# EAGLE design main (EAGLE 8.3.1)
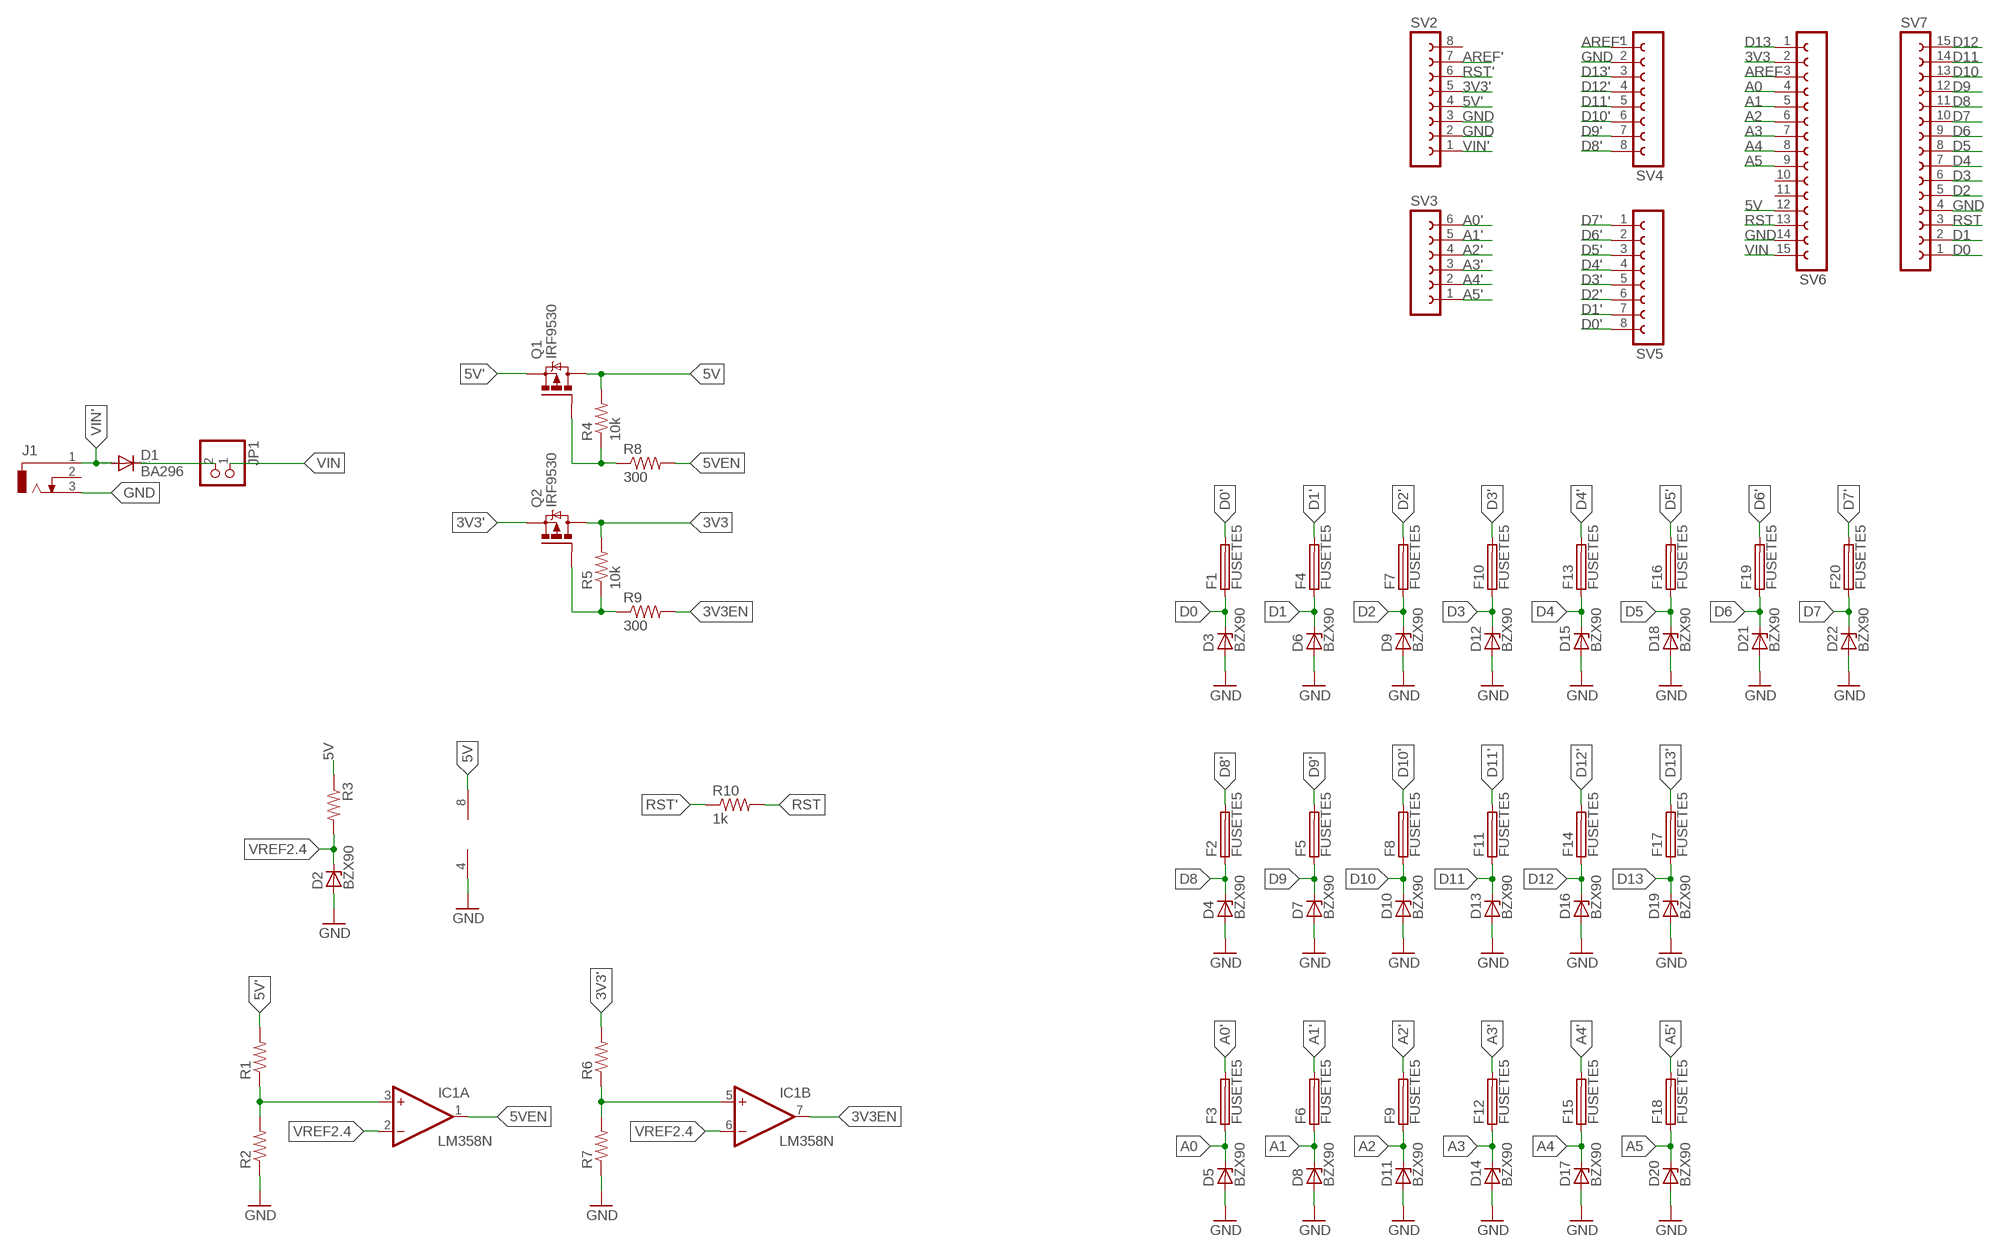
[diagram p0: schematic, sheet 1]

## Parts
D1  BA296  [P2-15]
D2  BZX90  [DO34Z7]
D3  BZX90  [DO34Z7]
D4  BZX90  [DO34Z7]
D5  BZX90  [DO34Z7]
D6  BZX90  [DO34Z7]
D7  BZX90  [DO34Z7]
D8  BZX90  [DO34Z7]
D9  BZX90  [DO34Z7]
D10  BZX90  [DO34Z7]
D11  BZX90  [DO34Z7]
D12  BZX90  [DO34Z7]
D13  BZX90  [DO34Z7]
D14  BZX90  [DO34Z7]
D15  BZX90  [DO34Z7]
D16  BZX90  [DO34Z7]
D17  BZX90  [DO34Z7]
D18  BZX90  [DO34Z7]
D19  BZX90  [DO34Z7]
D20  BZX90  [DO34Z7]
D21  BZX90  [DO34Z7]
D22  BZX90  [DO34Z7]
F1  FUSETE5  [TE5]
F2  FUSETE5  [TE5]
F3  FUSETE5  [TE5]
F4  FUSETE5  [TE5]
F5  FUSETE5  [TE5]
F6  FUSETE5  [TE5]
F7  FUSETE5  [TE5]
F8  FUSETE5  [TE5]
F9  FUSETE5  [TE5]
F10  FUSETE5  [TE5]
F11  FUSETE5  [TE5]
F12  FUSETE5  [TE5]
F13  FUSETE5  [TE5]
F14  FUSETE5  [TE5]
F15  FUSETE5  [TE5]
F16  FUSETE5  [TE5]
F17  FUSETE5  [TE5]
F18  FUSETE5  [TE5]
F19  FUSETE5  [TE5]
F20  FUSETE5  [TE5]
IC1  LM358N  [DIL08]
J1  DCJ0303  [DCJ0303]
JP1  PINHD-1X2  [1X02]
Q1  IRF9530  [TO220BV]
Q2  IRF9530  [TO220BV]
R1  R-US_0204/7  [0204/7]
R2  R-US_0204/7  [0204/7]
R3  R-US_0204/7  [0204/7]
R4  10k  R-US_0204/7  [0204/7]
R5  10k  R-US_0204/7  [0204/7]
R6  R-US_0204/7  [0204/7]
R7  R-US_0204/7  [0204/7]
R8  300  R-US_0204/7  [0204/7]
R9  300  R-US_0204/7  [0204/7]
R10  1k  R-US_0204/7  [0204/7]
SV2  FE08-1  [FE08]
SV3  FE06-1  [FE06]
SV4  FE08-1  [FE08]
SV5  FE08-1  [FE08]
SV6  FE15-1  [FE15]
SV7  FE15-1  [FE15]

## Nets
3V3: Q2.D R5.2 SV6.2
3V3': Q2.S R6.2 SV2.5
3V3EN: IC1.7(B:OUT) R9.2
5V: IC1.8(P:V+) Q1.D R3.1 R4.2 SV6.12
5V': Q1.S R1.2 SV2.4
5VEN: IC1.1(A:OUT) R8.2
A0: D5.C F3.1 SV6.4
A0': F3.2 SV3.6
A1: D8.C F6.1 SV6.5
A1': F6.2 SV3.5
A2: D11.C F9.1 SV6.6
A2': F9.2 SV3.4
A3: D14.C F12.1 SV6.7
A3': F12.2 SV3.3
A4: D17.C F15.1 SV6.8
A4': F15.2 SV3.2
A5: D20.C F18.1 SV6.9
A5': F18.2 SV3.1
AREF: SV6.3
AREF': SV2.7 SV4.1
D0: D3.C F1.1 SV7.1
D0': F1.2 SV5.8
D1: D6.C F4.1 SV7.2
D1': F4.2 SV5.7
D2: D9.C F7.1 SV7.5
D2': F7.2 SV5.6
D3: D12.C F10.1 SV7.6
D3': F10.2 SV5.5
D4: D15.C F13.1 SV7.7
D4': F13.2 SV5.4
D5: D18.C F16.1 SV7.8
D5': F16.2 SV5.3
D6: D21.C F19.1 SV7.9
D6': F19.2 SV5.2
D7: D22.C F20.1 SV7.10
D7': F20.2 SV5.1
D8: D4.C F2.1 SV7.11
D8': F2.2 SV4.8
D9: D7.C F5.1 SV7.12
D9': F5.2 SV4.7
D10: D10.C F8.1 SV7.13
D10': F8.2 SV4.6
D11: D13.C F11.1 SV7.14
D11': F11.2 SV4.5
D12: D16.C F14.1 SV7.15
D12': F14.2 SV4.4
D13: D19.C F17.1 SV6.1
D13': F17.2 SV4.3
GND: D2.A D3.A D4.A D5.A D6.A D7.A D8.A D9.A D10.A D11.A D12.A D13.A D14.A D15.A D16.A D17.A D18.A D19.A D20.A D21.A D22.A IC1.4(P:V-) J1.3 R2.1 R7.1 SV2.2 SV2.3 SV4.2 SV6.14 SV7.4
N$2: D1.C JP1.2
N$3: Q2.G R5.1 R9.1
N$4: Q1.G R4.1 R8.1
N$6: IC1.3(A:+IN) R1.1 R2.2
N$7: IC1.5(B:+IN) R6.1 R7.2
RST: R10.2 SV6.13 SV7.3
RST': R10.1 SV2.6
VIN: JP1.1 SV6.15
VIN': D1.A J1.1 SV2.1
VREF2.4: D2.C IC1.2(A:-IN) IC1.6(B:-IN) R3.2
Unconnected: J1.2 SV2.8 SV6.10 SV6.11

## Library data of the parts
D1 = diode:BA296: DIODE
D2-D22 = diode:BZX90: Z DIODE
F1-F20 = fuse:FUSE: Fuse; OC_FARNELL: unknown; OC_NEWARK: unknown
IC1 = linear:LM358: OP AMP also LM158; LM258; LM2904 Source: http://cache.national.com/ds/LM/LM158.pdf
J1 = con-jack:DCJ0303: DC POWER JACK Source: DCJ0303.pdf; OC_FARNELL: unknown; OC_NEWARK: unknown
JP1 = pinhead:PINHD-1X2: PIN HEADER
Q1 Q2 = transistor-power:IRF9530: P-CHANNEL HEXFET POWER-MOS-FET Source: http://www.irf.com/product-info/datasheets/data/irf9530.pdf
R1-R10 = rcl:R-US_: RESISTOR, American symbol
SV2 SV4 SV5 = con-lsta:FE08-1: FEMALE HEADER; OC_FARNELL: unknown; OC_NEWARK: unknown
SV3 = con-lsta:FE06-1: FEMALE HEADER; OC_FARNELL: unknown; OC_NEWARK: unknown
SV6 SV7 = con-lsta:FE15-1: FEMALE HEADER; OC_FARNELL: unknown; OC_NEWARK: unknown

## Board
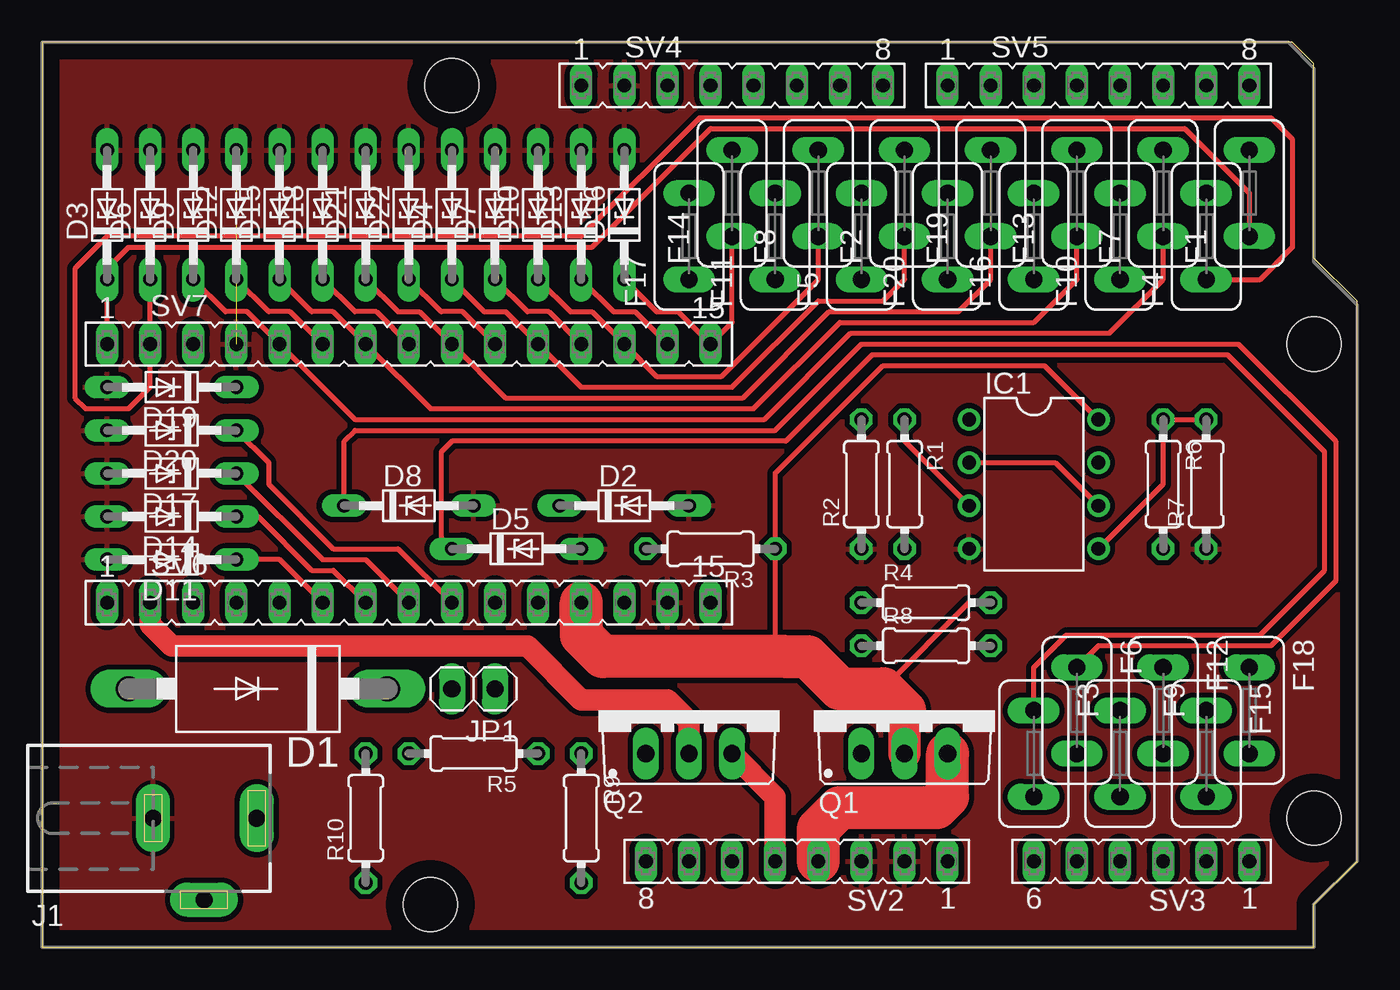
[diagram p1: board, top side]
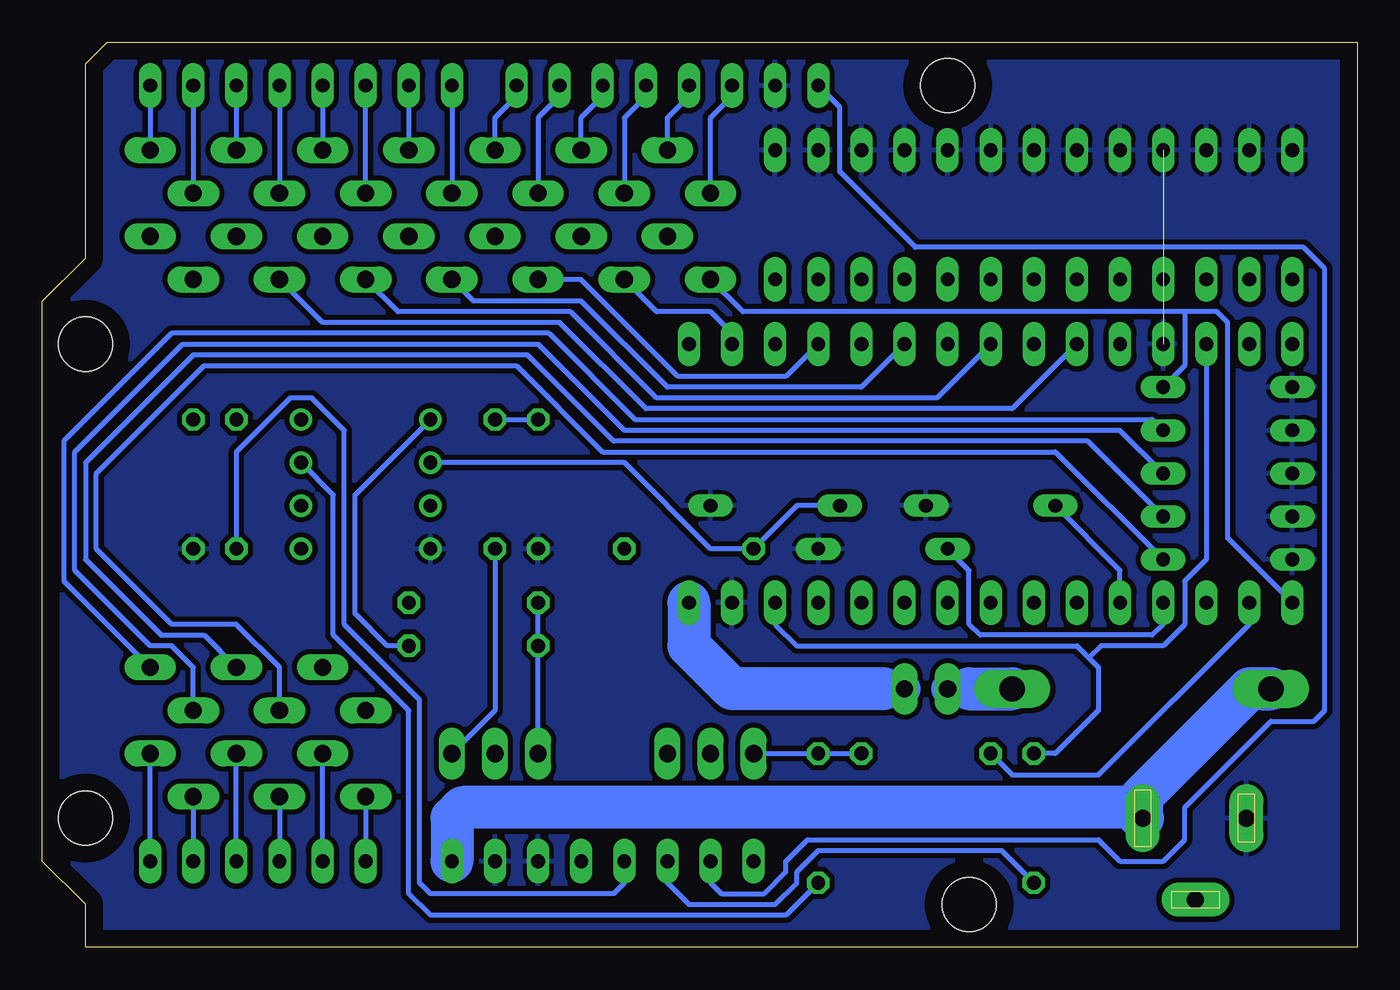
[diagram p2: board, bottom side, seen from below]

Size 77.47 x 53.34 mm. Coordinates in mm from the lower left corner, seen from the top.
Outline: 0,0 74.93,0 74.93,2.54 77.47,5.08 77.47,38.1 74.93,40.64 74.93,52.07 73.66,53.34 0,53.34 0,0
Copper layers (1*16): Top 0.035mm / dielectric 1.5mm / Bottom 0.035mm
Design rules "default": minimum track width 6mil, minimum drill 0.35mm, track to track 6mil, track to pad 6mil, pad to pad 6mil, via to via 6mil, smd to smd 6mil, copper to edge 40mil, drill to drill 6mil, minimum pad ring 10mil, minimum via ring 8mil, stop-mask expansion 4mil, vias tented up to drill 0mil, thermal gap 10mil
Holes 3.17 mm at 24.13,50.8 74.93,35.56 74.93,7.62 22.86,2.54

### Footprints (pad centres in the part's own frame; a part is rotated, then mirrored left to right if it is on the bottom)
P2-15 = drill 1.499 long: A 7.62,0; C -7.62,0
DO34Z7 = drill 0.813 long: A 3.81,0; C -3.81,0
TE5 = drill 1.016 long: 1 -2.54,0; 2 2.54,0
DIL08 = drill 0.813 pad 1.27: 1 -3.81,-3.81; 2 -1.27,-3.81; 3 1.27,-3.81; 4 3.81,-3.81; 5 3.81,3.81; 6 1.27,3.81; 7 -1.27,3.81; 8 -3.81,3.81
DCJ0303 = drill 1 pad 2 long: 1 0,3.1; 2 4.8,0; 3 0,-3
1X02 = drill 1.016 long: 1 -1.27,0; 2 1.27,0
TO220BV = drill 1.016 long: D 0,-2.54; G -2.54,-2.54; S 2.54,-2.54
0204/7 = drill 0.813 octagon: 1 -3.81,0; 2 3.81,0
FE08 = drill 0.813 long: 1 -8.89,0; 2 -6.35,0; 3 -3.81,0; 4 -1.27,0; 5 1.27,0; 6 3.81,0; 7 6.35,0; 8 8.89,0
FE06 = drill 0.813 long: 1 -6.35,0; 2 -3.81,0; 3 -1.27,0; 4 1.27,0; 5 3.81,0; 6 6.35,0
FE15 = drill 0.813 long: 1 -17.78,0; 2 -15.24,0; 3 -12.7,0; 4 -10.16,0; 5 -7.62,0; 6 -5.08,0; 7 -2.54,0; 8 0,0; 9 2.54,0; 10 5.08,0; 11 7.62,0; 12 10.16,0; 13 12.7,0; 14 15.24,0; 15 17.78,0

### Placement (x,y rotation side)
D1  12.7,15.24 180 top
D2  34.29,26.03 0 top
D3  3.81,43.18 90 top
D4  24.13,43.18 90 top
D5  27.94,23.49 0 top
D6  6.35,43.18 90 top
D7  26.67,43.18 90 top
D8  21.59,26.03 0 top
D9  8.89,43.18 90 top
D10  29.21,43.18 90 top
D11  7.62,22.86 180 top
D12  11.43,43.18 90 top
D13  31.75,43.18 90 top
D14  7.62,25.4 180 top
D15  13.97,43.18 90 top
D16  34.29,43.18 90 top
D17  7.62,27.94 180 top
D18  16.51,43.18 90 top
D19  7.62,33.02 180 top
D20  7.62,30.48 180 top
D21  19.05,43.18 90 top
D22  21.59,43.18 90 top
F1  71.12,44.45 90 top
F2  50.8,44.45 90 top
F3  58.42,11.43 270 top
F4  68.58,41.91 90 top
F5  48.26,41.91 90 top
F6  60.96,13.97 270 top
F7  66.04,44.45 90 top
F8  45.72,44.45 90 top
F9  63.5,11.43 270 top
F10  63.5,41.91 90 top
F11  43.18,41.91 90 top
F12  66.04,13.97 270 top
F13  60.96,44.45 90 top
F14  40.64,44.45 90 top
F15  68.58,11.43 270 top
F16  58.42,41.91 90 top
F17  38.1,41.91 90 top
F18  71.12,13.97 270 top
F19  55.88,44.45 90 top
F20  53.34,41.91 90 top
IC1  58.42,27.3 270 top
J1  9.53,7.62 270 top
JP1  25.4,15.24 180 top
Q1  50.8,13.97 0 top
Q2  38.1,13.97 0 top
R1  50.8,27.3 270 top
R2  48.26,27.3 90 top
R3  39.37,23.49 180 top
R4  52.07,20.32 0 top
R5  25.4,11.43 180 top
R6  66.04,27.3 270 top
R7  68.58,27.3 90 top
R8  52.07,17.78 0 top
R9  31.75,7.62 270 top
R10  19.05,7.62 90 top
SV2  44.45,5.08 180 top
SV3  64.77,5.08 180 top
SV4  40.64,50.8 0 top
SV5  62.23,50.8 0 top
SV6  21.59,20.32 0 top
SV7  21.59,35.56 0 top

### Tracks (layer width: path | path; a pad name or v marks a point on that pad's centre or on a via)
3V3
  Top 1.27: SV6.2 6.35,19.05 7.62,17.78 28.57,17.78 31.75,14.6 36.83,14.6 38.1,13.34 Q2.D
  Bottom 0.305: R5.2 20.32,10.16 15.24,10.16 6.35,19.05 SV6.2
3V3'
  Top 1.27: SV2.5 43.18,8.89 Q2.S
  Bottom 0.305: SV2.5 43.18,3.81 43.81,3.18 54.61,3.18 55.24,3.81 55.24,14.6 59.69,19.05 59.69,30.48 61.59,32.38 62.87,32.38 66.04,29.21 R6.2
3V3EN
  Bottom 0.305: R9.2 33.66,1.91 54.61,1.91 55.88,3.18 55.88,13.97 60.32,18.41 60.32,26.67 IC1.7
5V
  Top 0.305: R4.2 54.61,20.32 49.53,15.24 | IC1.8 59.05,34.29 49.53,34.29 43.18,27.94 R3.1 43.18,17.79 43.82,17.15
  Top 1.905: Q1.D 50.8,13.97
  Top 2.54: 31.75,19.05 SV6.12 31.75,18.41 33.02,17.15 43.82,17.15 45.09,17.15 46.99,15.24 49.53,15.24 50.8,13.97
5V'
  Top 2.54: SV2.4 45.72,6.98 46.99,8.25 52.7,8.25 53.34,8.89 Q1.S
  Bottom 0.305: R1.2 50.8,13.97 Q1.S
5VEN
  Bottom 0.305: R8.2 57.15,17.78 59.05,19.69 59.05,26.67 IC1.1
A0
  Top 0.305: F3.1 58.42,16.51 60.32,18.41 71.76,18.41 75.57,22.23 75.57,29.21 69.85,34.92 48.89,34.92 43.81,29.84 24.13,29.84 23.49,29.21 23.49,24.13 D5.C
  Bottom 0.305: SV6.4 11.43,19.05 12.06,18.41 22.23,18.41 22.86,19.05 22.86,22.23 D5.C
A0'
  Bottom 0.305: F3.2 SV3.6
A1
  Top 0.305: D8.C 17.78,29.84 18.41,30.48 43.18,30.48 48.26,35.56 70.48,35.56 76.2,29.84 76.2,21.59 72.39,17.78 62.23,17.78 F6.1
  Bottom 0.305: SV6.5 13.97,22.23 D8.C
A1'
  Bottom 0.305: SV3.5 F6.2
A2
  Top 0.305: SV6.6 13.97,22.86 D11.C
  Bottom 0.305: F9.1 63.5,16.51 66.04,19.05 69.85,19.05 74.3,23.49 74.3,27.94 67.95,34.29 49.53,34.29 44.45,29.21 17.78,29.21 D11.C
A2'
  Bottom 0.305: F9.2 SV3.4
A3
  Top 0.305: D14.C 12.7,25.4 15.88,22.23 17.15,22.23 SV6.7
  Bottom 0.305: F12.1 67.95,18.41 70.48,18.41 74.93,22.86 74.93,28.58 68.58,34.92 48.89,34.92 43.81,29.84 15.88,29.84 D14.C
A3'
  Bottom 0.305: SV3.3 F12.2
A4
  Top 0.305: D17.C 16.51,22.86 19.05,22.86 SV6.8
  Bottom 0.305: F15.1 68.58,16.51 69.85,17.78 71.12,17.78 75.57,22.23 75.57,29.21 69.22,35.56 48.26,35.56 43.18,30.48 13.97,30.48 D17.C
A4'
  Bottom 0.305: F15.2 SV3.2
A5
  Top 0.305: D20.C 13.33,28.58 13.33,27.3 17.15,23.49 20.95,23.49 SV6.9
  Bottom 0.305: F18.1 76.2,21.59 76.2,29.84 69.85,36.2 47.62,36.2 42.55,31.12 12.06,31.12 D20.C
A5'
  Bottom 0.305: SV3.1 F18.2
AREF'
  Bottom 0.305: SV2.7 38.1,3.81 37.46,3.18 34.92,3.18 33.66,4.45 33.66,5.08 32.38,6.35 15.24,6.35 13.97,5.08 11.43,5.08 10.16,6.35 10.16,8.25 5.08,13.34 2.54,13.34 1.91,13.97 1.91,40.01 3.18,41.27 26.03,41.27 30.48,45.72 30.48,49.53 SV4.1
D0
  Top 0.305: SV7.1 D3.C 3.81,40.01 5.08,41.27 32.38,41.27 39.37,48.26 67.31,48.26 71.12,44.45 F1.1
D0'
  Bottom 0.305: SV5.8 F1.2
D1
  Top 0.305: D6.C SV7.2 6.35,33.02 5.08,31.75 2.54,31.75 1.91,32.38 1.91,40.01 3.81,41.91 31.75,41.91 38.73,48.9 72.39,48.9 73.66,47.62 73.66,41.27 71.76,39.37 F4.1
D1'
  Bottom 0.305: SV5.7 F4.2
D2
  Top 0.305: D9.C 10.79,37.46 12.06,37.46 SV7.5 18.41,31.12 42.55,31.12 47.62,36.2 62.87,36.2 66.04,39.37 F7.1
D2'
  Bottom 0.305: SV5.6 F7.2
D3
  Top 0.305: SV7.6 14.6,37.46 13.33,37.46 D12.C
  Bottom 0.305: SV7.6 20.32,31.75 41.91,31.75 46.99,36.83 60.96,36.83 F10.1
D3'
  Bottom 0.305: SV5.5 F10.2
D4
  Top 0.305: D15.C 15.88,37.46 17.15,37.46 SV7.7 22.86,31.75 41.91,31.75 46.99,36.83 58.42,36.83 60.96,39.37 F13.1
D4'
  Bottom 0.305: SV5.4 F13.2
D5
  Top 0.305: SV7.8 19.69,37.46 18.41,37.46 D18.C
  Bottom 0.305: SV7.8 24.77,32.38 41.27,32.38 46.35,37.46 56.52,37.46 F16.1
D5'
  Bottom 0.305: F16.2 SV5.3
D6
  Top 0.305: D21.C 20.95,37.46 22.23,37.46 SV7.9 27.3,32.38 41.27,32.38 46.35,37.46 53.98,37.46 55.88,39.37 F19.1
D6'
  Bottom 0.305: SV5.2 F19.2
D7
  Top 0.305: SV7.10 24.77,37.46 23.49,37.46 D22.C
  Bottom 0.305: SV7.10 29.21,33.02 40.64,33.02 45.72,38.1 52.07,38.1 F20.1
D7'
  Bottom 0.305: SV5.1 F20.2
D8
  Top 0.305: D4.C 26.03,37.46 27.3,37.46 SV7.11 31.75,33.02 40.64,33.02 45.72,38.1 49.53,38.1 50.8,39.37 F2.1
D8'
  Bottom 0.305: F2.2 50.8,48.9 49.53,50.16 SV4.8
D9
  Top 0.305: SV7.12 29.84,37.46 28.57,37.46 D7.C
  Bottom 0.305: SV7.12 33.66,33.66 40,33.66 45.72,39.37 F5.1
D9'
  Bottom 0.305: SV4.7 46.99,50.16 48.26,48.9 F5.2
D10
  Top 0.305: D10.C 31.12,37.46 32.38,37.46 SV7.13 36.2,33.66 40,33.66 45.72,39.37 F8.1
D10'
  Bottom 0.305: F8.2 45.72,48.9 44.45,50.16 SV4.6
D11
  Top 0.305: D13.C 33.66,37.46 34.92,37.46 SV7.14
  Bottom 0.305: SV7.14 36.83,36.2 38.1,37.46 41.27,37.46 F11.1
D11'
  Bottom 0.305: SV4.5 41.91,50.16 43.18,48.9 F11.2
D12
  Top 0.305: D16.C 36.2,37.46 37.46,37.46 SV7.15 40.64,36.83 F14.1
D12'
  Bottom 0.305: F14.2 40.64,48.9 39.37,50.16 SV4.4
D13
  Bottom 0.305: SV6.1 7.62,24.13 7.62,36.83 8.26,37.46 10.16,37.46 | 10.16,37.46 36.2,37.46 F17.1 | 10.16,37.46 10.16,34.29 D19.C
D13'
  Bottom 0.305: F17.2 38.1,48.9 36.83,50.16 SV4.3
GND  (1 unrouted)
  pour Bottom (isolate 0.305): 0,0 74.93,0 74.93,2.54 77.47,5.08 77.47,38.1 74.93,40.64 74.93,52.07 73.66,53.34 0,53.34
  pour Top (isolate 0.305): 0,0 74.93,0 74.93,2.54 77.47,5.08 77.47,38.1 74.93,40.64 74.93,52.07 73.66,53.34 0,53.34
N$2
  Bottom 1.905: JP1.2 22.86,15.24
  Bottom 2.54: 22.86,15.24 D1.C
N$3
  Bottom 0.305: Q2.G R9.1 R5.1
N$4
  Bottom 0.305: Q1.G R8.1 R4.1
N$6
  Top 0.305: R1.1 50.8,29.84 IC1.3
  Bottom 0.305: R1.1 R2.2
N$7
  Top 0.305: IC1.5 66.04,27.3 R6.1 R7.2
RST
  Bottom 0.305: SV6.13 34.29,19.05 33.02,17.78 16.51,17.78 15.79,17.06 | 15.79,17.06 15.24,16.51 15.24,13.97 17.78,11.43 R10.2 | SV7.3 8.89,22.86 10.16,21.59 10.16,19.05 11.43,17.78 15.08,17.78 15.79,17.06
RST'
  Bottom 0.305: SV2.6 40.64,3.81 39.37,2.54 34.29,2.54 33.02,3.81 33.02,4.45 31.75,5.71 20.95,5.71 R10.1
VIN
  Bottom 1.905: JP1.1 27.94,15.24
  Bottom 2.54: SV6.15 39.37,17.78 36.83,15.24 27.94,15.24
VIN'
  Bottom 2.54: 5.64,15.24 D1.A 6.35,15.24 12.7,8.89 12.7,7.7 J1.1 12.7,7.62 13.33,8.25 52.7,8.25 53.34,7.62 SV2.1
VREF2.4
  Top 0.305: IC1.2 59.69,28.58 IC1.6
  Bottom 0.305: D2.C 33.02,26.03 R3.2 38.1,23.49 43.18,28.58 IC1.2

### Text on the board
tDocu: SDA | AREF | GND | D13 | D12 | D11 | D10 | D9 | D8 | D7 | D6 | D5 | D4 | D3 | D2 | D1/TXO | D0/RXI | SCL | MISO | 5V | MOSI | SCK | RST | GND | IOREF | !RESET! | 3.3V | 5V | GND | GND | VIN | A0 | A1 | A2 | A3 | A4 | A5